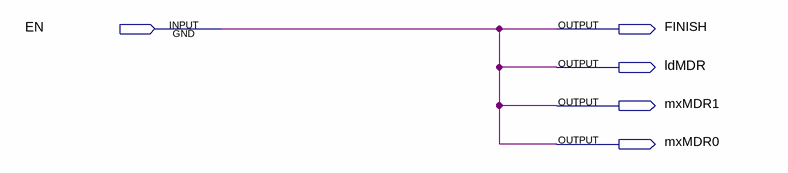
[diagram p0: schematic sheet]
// Quartus schematic immed.bdf as structural Verilog: 0 symbols, 5 pins
module immed (
  input  EN,
  output FINISH,
  output ldMDR,
  output mxMDR1,
  output mxMDR0
);


  assign FINISH = EN;
  assign ldMDR = EN;
  assign mxMDR0 = EN;
  assign mxMDR1 = EN;
endmodule
